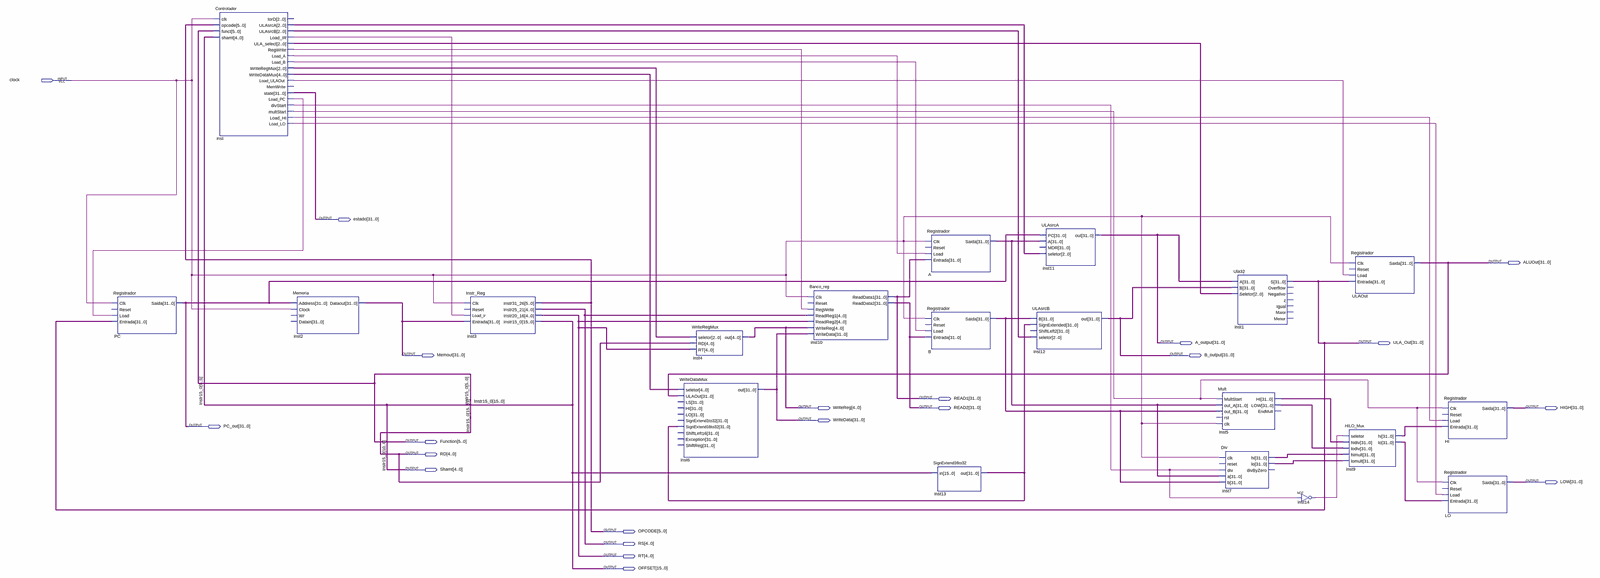
[diagram p0: schematic sheet, whole]
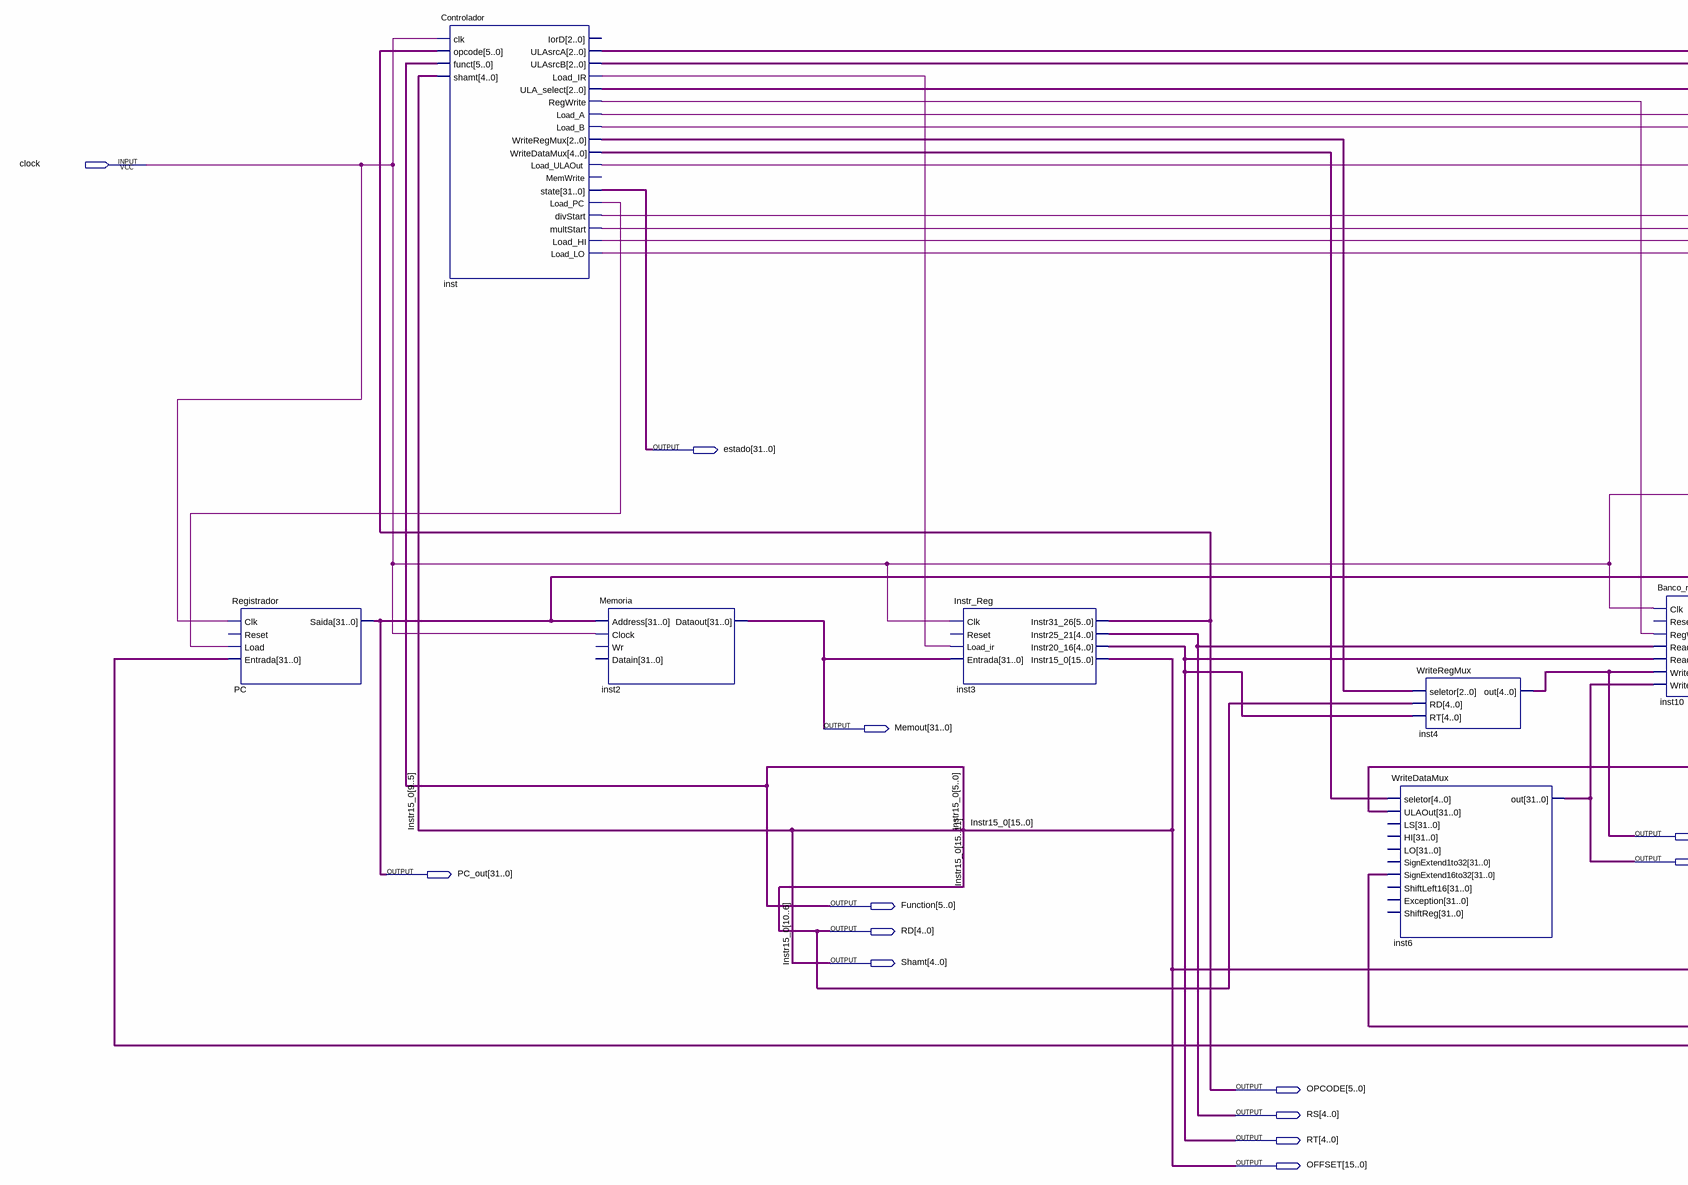
[diagram p1: schematic sheet, left part]
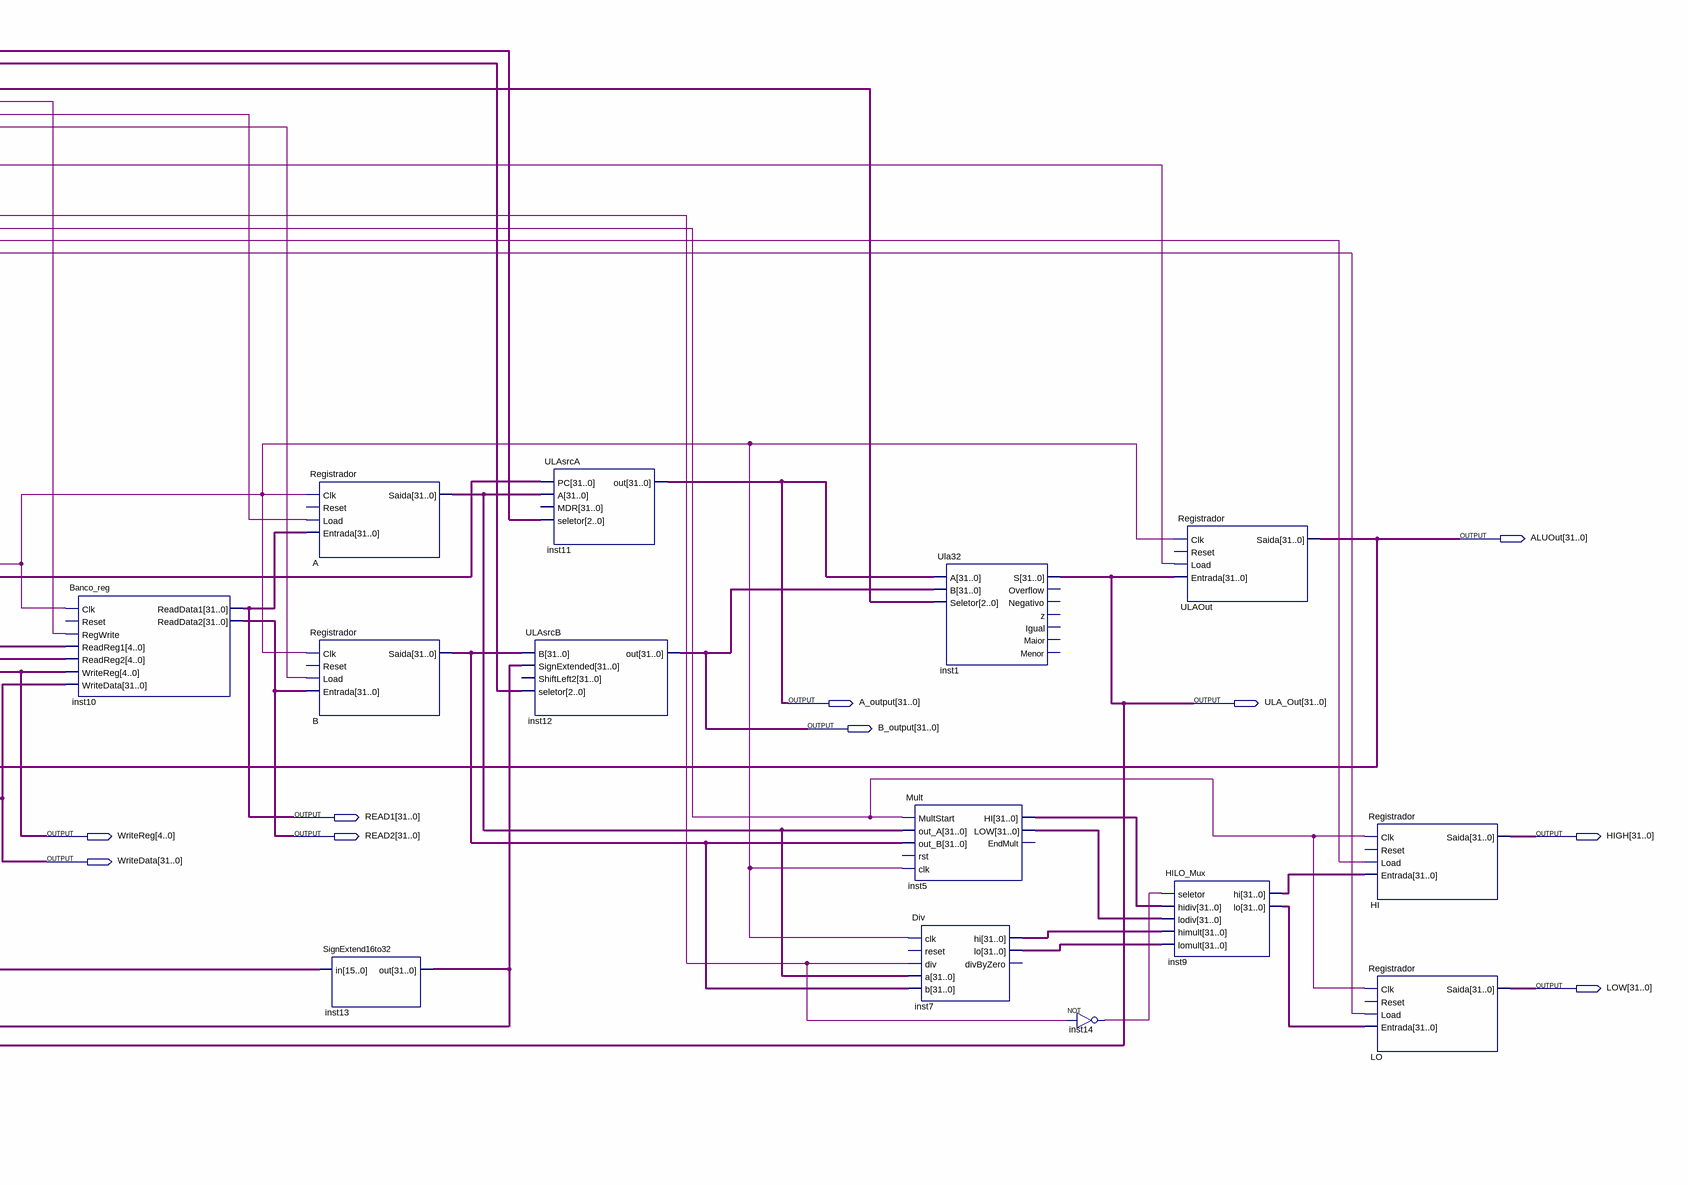
[diagram p2: schematic sheet, right part]
// Quartus schematic bloco_teste1.bdf as structural Verilog: 20 symbols, 21 pins
module bloco_teste1 (
  input  clock,
  output [31:0] estado,
  output [31:0] ALUOut,
  output [31:0] A_output,
  output [31:0] ULA_Out,
  output [31:0] Memout,
  output [31:0] B_output,
  output [31:0] READ1,
  output [4:0] WriteReg,
  output [31:0] READ2,
  output [31:0] HIGH,
  output [31:0] WriteData,
  output [31:0] PC_out,
  output [5:0] Function,
  output [4:0] RD,
  output [4:0] Shamt,
  output [31:0] LOW,
  output [5:0] OPCODE,
  output [4:0] RS,
  output [4:0] RT,
  output [15:0] OFFSET
);

  wire inst14_out, inst_divstart, inst_load_a, inst_load_b, inst_load_hi, inst_load_ir, inst_load_lo,
       inst_load_pc, inst_load_ulaout, inst_multstart, inst_regwrite;
  wire [2:0] inst_ula_select, inst_ulasrca, inst_ulasrcb, inst_writeregmux;
  wire [4:0] inst_writedatamux;
  wire [31:0] A_saida, B_saida, inst5_hi, inst5_low, inst7_hi, inst7_lo, inst9_hi, inst9_lo, inst13_out;

  Registrador PC (.Clk(clock), .Load(inst_load_pc), .Entrada(ULA_Out), .Saida(PC_out));  // open: Reset
  Controlador inst (
    .clk(clock), .opcode(OPCODE), .funct(Function), .shamt({OFFSET[9:6], Function[5]}),
    .ULAsrcA(inst_ulasrca), .ULAsrcB(inst_ulasrcb), .Load_IR(inst_load_ir), .ULA_select(inst_ula_select),
    .RegWrite(inst_regwrite), .Load_A(inst_load_a), .Load_B(inst_load_b), .WriteRegMux(inst_writeregmux),
    .WriteDataMux(inst_writedatamux), .Load_ULAOut(inst_load_ulaout), .state(estado), .Load_PC(inst_load_pc),
    .divStart(inst_divstart), .multStart(inst_multstart), .Load_HI(inst_load_hi), .Load_LO(inst_load_lo));  // open: IorD, MemWrite
  Memoria inst2 (.Address(PC_out), .Clock(clock), .Dataout(Memout));  // open: Wr, Datain
  Instr_Reg inst3 (
    .Clk(clock), .Load_ir(inst_load_ir), .Entrada(Memout), .Instr31_26(OPCODE), .Instr25_21(RS),
    .Instr20_16(RT), .Instr15_0({OFFSET[15:6], Function}));  // open: Reset
  WriteRegMux inst4 (.seletor(inst_writeregmux), .RD(OFFSET[15:11]), .RT(RT), .out(WriteReg));
  WriteDataMux inst6 (
    .seletor(inst_writedatamux), .ULAOut(ALUOut), .SignExtend16to32(inst13_out), .out(WriteData));  // open: LS, HI, LO, SignExtend1to32, ShiftLeft16, Exception, ShiftReg
  Banco_reg inst10 (
    .Clk(clock), .RegWrite(inst_regwrite), .ReadReg1(RS), .ReadReg2(RT), .WriteReg(WriteReg),
    .WriteData(WriteData), .ReadData1(READ1), .ReadData2(READ2));  // open: Reset
  Registrador A (.Clk(clock), .Load(inst_load_a), .Entrada(READ1), .Saida(A_saida));  // open: Reset
  Registrador B (.Clk(clock), .Load(inst_load_b), .Entrada(READ2), .Saida(B_saida));  // open: Reset
  SignExtend16to32 inst13 (.in({OFFSET[15:6], Function}), .out(inst13_out));
  ULAsrcB inst12 (.B(B_saida), .SignExtended(inst13_out), .seletor(inst_ulasrcb), .out(B_output));  // open: ShiftLeft2
  ULAsrcA inst11 (.PC(PC_out), .A(A_saida), .seletor(inst_ulasrca), .out(A_output));  // open: MDR
  Ula32 inst1 (
    .A(A_output), .B(B_output), .Seletor(inst_ula_select), .S(ULA_Out));  // open: Overflow, Negativo, z, Igual, Maior, Menor
  Mult inst5 (
    .MultStart(inst_multstart), .out_A(A_saida), .out_B(B_saida), .clk(clock), .HI(inst5_hi), .LOW(inst5_low));  // open: rst, EndMult
  Div inst7 (
    .clk(clock), .div(inst_divstart), .a(A_saida), .b(B_saida), .hi(inst7_hi), .lo(inst7_lo));  // open: reset, divByZero
  not inst14 (inst14_out, inst_divstart);
  Registrador ULAOut (.Clk(clock), .Load(inst_load_ulaout), .Entrada(ULA_Out), .Saida(ALUOut));  // open: Reset
  HILO_Mux inst9 (
    .seletor(inst14_out), .hidiv(inst5_hi), .lodiv(inst5_low), .himult(inst7_hi), .lomult(inst7_lo),
    .hi(inst9_hi), .lo(inst9_lo));
  Registrador HI (.Clk(inst_multstart), .Load(inst_load_hi), .Entrada(inst9_hi), .Saida(HIGH));  // open: Reset
  Registrador LO (.Clk(inst_multstart), .Load(inst_load_lo), .Entrada(inst9_lo), .Saida(LOW));  // open: Reset

  assign OFFSET[5:0] = Function;
  assign RD = OFFSET[15:11];
  assign Shamt = OFFSET[10:6];

  // Other names for the same wires on the sheet: Instr15_0[15:0] = {OFFSET[15:6], Function}
endmodule
